# Altium schematic sheet USB_OTG_FS.SchDoc
size A4
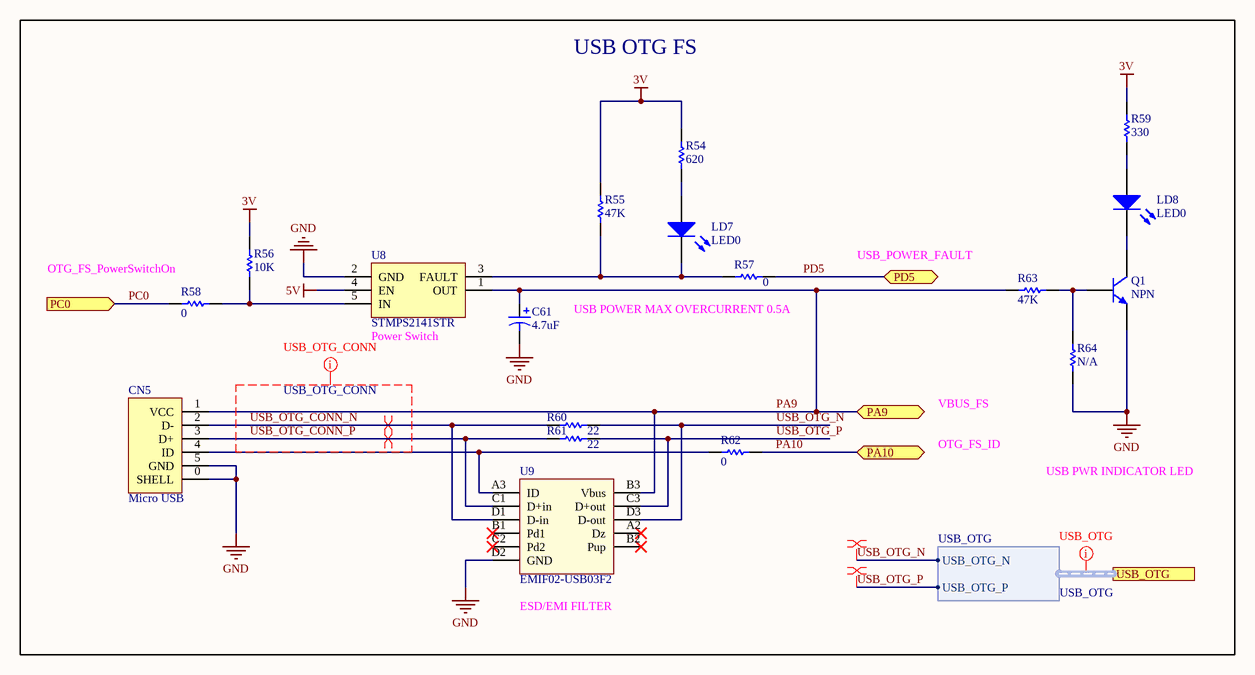
[diagram p0: USB_OTG_FS.SchDoc]

## Parts
C61  value 4.7uF  [TANTALUM CASE A_LEVEL B]  (hidden comment: Cap Pol1)
CN5  Micro USB  [USB MICRO]
LD7  LED0  [LED_0603]
LD8  LED0  [LED_0603]
Q1  NPN  [SOT-23]
R54  value 620  [RESC0402B]  (hidden comment: Res1)
R55  value 47K  [RESC0402B]  (hidden comment: Res1)
R56  value 10K  [RESC0603B]  (hidden comment: Res1)
R57  value 0  [RESC0603B]  (hidden comment: Res1)
R58  value 0  [RESC0603B]  (hidden comment: Res1)
R59  value 330  [RESC0402B]  (hidden comment: Res1)
R60  value 22  [RESC0402B]  (hidden comment: Res1)
R61  value 22  [RESC0402B]  (hidden comment: Res1)
R62  value 0  [RESC0603B]  (hidden comment: Res1)
R63  value 47K  [RESC0402B]  (hidden comment: Res1)
R64  Res1  [RESC0402B]  (value not drawn)
U8  STMPS2141STR  [TSOT-23-5]
U9  EMIF02-USB03F2  [EMIF02-USB03F2]

## Ports
PA9 (bidir), PA10 (bidir), PC0 (in), PD5 (bidir), USB_OTG (harness USB_OTG)

## Harnesses
USB_OTG: USB_OTG_N, USB_OTG_P

## Nets
3V: R54.2 R55.2 R56.2 R59.2
5V: U8.4(EN)
GND: C61.2 CN5.0(SHELL) CN5.5(GND) Q1.3(E) R64.1 U8.2(GND) U9.D2(GND)
PA9: C61.1 CN5.1(VCC) R63.2 U8.1(OUT) U9.B3(Vbus) ; port PA9
PA10: R62.2 ; port PA10
PC0: R58.2 ; port PC0
PD5: R57.2 ; port PD5
USB_OTG_CONN_N: CN5.2(D-) R60.1 U9.D1(D-in)
USB_OTG_CONN_P: CN5.3(D+) R61.1 U9.C1(D+in)
USB_OTG_N: R60.2 U9.D3(D-out) ; port USB_OTG.USB_OTG_N
USB_OTG_P: R61.2 U9.C3(D+out) ; port USB_OTG.USB_OTG_P
NetCN5_4: CN5.4(ID) R62.1 U9.A3(ID)
NetLD7_1: LD7.1(A) R54.1
NetLD7_2: LD7.2(K) R55.1 R57.1 U8.3(FAULT)
NetLD8_1: LD8.1(A) R59.1
NetLD8_2: LD8.2(K) Q1.1(C)
NetQ1_2: Q1.2(B) R63.1 R64.2
NetR56_1: R56.1 R58.1 U8.5(IN)

Not connected (* = marked no-connect by the designer): U9 A2(Dz)* B1(Pd1)* B2(Pup)* C2(Pd2)*

## Layout directives
differential pair: USB_OTG_CONN_N, USB_OTG_CONN_P, USB_OTG_N, USB_OTG_P
net class USB_OTG_CONN: USB_OTG_CONN_N, USB_OTG_CONN_P
net class USB_OTG: (no net found under the mark)

## Notes on the sheet
- USB OTG FS
- (near R58) OTG_FS_PowerSwitchOn
- USB_POWER_FAULT
- (near U8) Power Switch
- (near R57) USB POWER MAX OVERCURRENT 0.5A
- VBUS_FS
- OTG_FS_ID
- USB PWR INDICATOR LED
- (near U9) ESD/EMI FILTER
- Title
- Size:
- Date:
- A4
- Number:
- Time:
- Revision:
- Sheet
- of
- File:

## Library data of the parts
C61 = Cap Pol1_1: Polarized Capacitor (Radial); Published: 8-Jun-2000; LatestRevisionDate: 17-Jul-2002; LatestRevisionNote: Re-released for DXP Platform.; PackageReference: RB7.6-15; Publisher: Altium Limited; PackageDescription: Polarized Capacitor (Radial); 2 Leads
CN5 = USB MICRO
LD7 LD8 = LED0: Typical INFRARED GaAs LED; Published: 8-Jun-2000; LatestRevisionDate: 08-Jul-2005; LatestRevisionNote: Mech Layer 1 removed.; PackageReference: LED-0; Publisher: Altium Limited; PackageDescription: LED; 2 Leads
Q1 = NPN: NPN Bipolar Transistor; Published: 8-Jun-2000; LatestRevisionDate: 17-Jul-2002; LatestRevisionNote: Re-released for DXP Platform.; PackageReference: TO-226-AA; Publisher: Altium Limited; PackageDescription: TO, Flat Index; 3 In-Line, Axial Leads; Body Dia. 4.8mm; Leads 0.55 x 0.51 mm (max); Code_JEDEC: TO-226-AA
R54 = Res1_10: Resistor; Published: 8-Jun-2000; LatestRevisionDate: 17-Jul-2002; LatestRevisionNote: Re-released for DXP Platform.; PackageReference: AXIAL-0.3; Publisher: Altium Limited; PackageDescription: Axial Device, Thru-Hole; 2 Leads; 0.3 in Pin Spacing
R55 R63 = Res1_9: Resistor; Published: 8-Jun-2000; LatestRevisionDate: 17-Jul-2002; LatestRevisionNote: Re-released for DXP Platform.; PackageReference: AXIAL-0.3; Publisher: Altium Limited; PackageDescription: Axial Device, Thru-Hole; 2 Leads; 0.3 in Pin Spacing
R56 = Res1_2: Resistor; Published: 8-Jun-2000; LatestRevisionDate: 17-Jul-2002; LatestRevisionNote: Re-released for DXP Platform.; PackageReference: AXIAL-0.3; Publisher: Altium Limited; PackageDescription: Axial Device, Thru-Hole; 2 Leads; 0.3 in Pin Spacing
R57 R58 R62 = Res1: Resistor; Published: 8-Jun-2000; LatestRevisionDate: 17-Jul-2002; LatestRevisionNote: Re-released for DXP Platform.; PackageReference: AXIAL-0.3; Publisher: Altium Limited; PackageDescription: Axial Device, Thru-Hole; 2 Leads; 0.3 in Pin Spacing
R59 = Res1_12: Resistor; Published: 8-Jun-2000; LatestRevisionDate: 17-Jul-2002; LatestRevisionNote: Re-released for DXP Platform.; PackageReference: AXIAL-0.3; Publisher: Altium Limited; PackageDescription: Axial Device, Thru-Hole; 2 Leads; 0.3 in Pin Spacing
R60 R61 = Res1_11: Resistor; Published: 8-Jun-2000; LatestRevisionDate: 17-Jul-2002; LatestRevisionNote: Re-released for DXP Platform.; PackageReference: AXIAL-0.3; Publisher: Altium Limited; PackageDescription: Axial Device, Thru-Hole; 2 Leads; 0.3 in Pin Spacing
R64 = Res1_13: Resistor; Published: 8-Jun-2000; LatestRevisionDate: 17-Jul-2002; LatestRevisionNote: Re-released for DXP Platform.; PackageReference: AXIAL-0.3; Publisher: Altium Limited; PackageDescription: Axial Device, Thru-Hole; 2 Leads; 0.3 in Pin Spacing; Value: N/A
U8 = STMPS2141STR: Manufacturer: STMicroelectronics; Other Related Documents: STMPS2141 View All Specifications; Switch Type: General Purpose; Number of Outputs: 1; Ratio - Input:Output: 1:1; Output Configuration: High Side; Output Type: N-Channel; Interface: On/Off; Voltage - Load: 2.7 V ~ 5.5 V; Voltage - Supply (Vcc/Vdd): Not Required; Current - Output (Max): 500mA; Rds On (Typ): 90 mOhm; Input Type: Non-Inverting; Fault Protection: Current Limiting (Fixed), Over Temperature, Reverse Current, UVLO; Other Names: 497-6933-2 / STMPS2141STR-ND; Supplier 1: Digikey; Manufacturer Part Number: STMPS2141STR; Stock 1: 9000; Pricing 1: 3000=0.2093, 6000=0.1958, 15000=0.1823, 30000=0.1728 (USD); Standard Package: 3,000; Category: Integrated Circuits (ICs); Family: PMIC - Power Distribution Switches, Load Drivers; Packaging: Tape & Reel (TR); Operating Temperature: -40°C ~ 125°C (TJ); Package / Case: SC-74A, SOT-753; Supplier Device Package: SOT-23-5; Online Catalog: General Purpose; ComponentLink1URL: https://datasheet.ciiva.com/4923/cd00167470-4923447.pdf; ComponentLink1Description: https://datasheet.ciiva.com/4923/cd00167470-4923447.pdf; ComponentLink2URL: https://datasheet.ciiva.com/1962/cd00167470-1962472.pdf; ComponentLink2Description: https://datasheet.ciiva.com/1962/cd00167470-1962472.pdf; ComponentLink3URL: https://datasheet.ciiva.com/1962/cd00167470-1962473.pdf; ComponentLink3Description: https://datasheet.ciiva.com/1962/cd00167470-1962473.pdf; ComponentLink4URL: https://datasheet.ciiva.com/1962/cd00167470-1962474.pdf; ComponentLink4Description: https://datasheet.ciiva.com/1962/cd00167470-1962474.pdf; ComponentLink5URL: https://datasheet.ciiva.com/16491/cd00167470-16491245.pdf; ComponentLink5Description: https://datasheet.ciiva.com/16491/cd00167470-16491245.pdf; ComponentLink6URL: https://datasheet.ciiva.com/15108/getdatasheetpartid-160072-15108990.pdf; ComponentLink6Description: https://datasheet.ciiva.com/15108/getdatasheetpartid-160072-15108990.pdf
U9 = EMIF02-USB03F2: Manufacturer: STMicroelectronics; Other Related Documents: EMIF02-USB03F2 View All Specifications; Number of Channels: 2; Resistance - Channel (Ohms): 33; Values: R = 33 Ohms, C = 20pF; ESD Protection: Yes; Filter Order: 2nd; Online Catalog: IPAD™ Series; Other Names: 497-13521-2 EMIF02USB03F2; Supplier 1: Digikey; Manufacturer Part Number: EMIF02-USB03F2; Stock 1: 5836; Pricing 1: 1=0.68, 10=0.644, 100=0.4574, 500=0.395, 1000=0.3534 (USD); Standard Package: 5,000; Category: Filters; Family: EMI/RFI Filters (LC, RC Networks); Series: EMIF; Packaging: Tape & Reel (TR); Type: Low Pass; Technology: RC (Pi); Center / Cutoff Frequency: -; Attenuation Value: -; Current: -; Applications: USB; Package / Case: 11-WFBGA, FCBGA; Size / Dimension: 0.076" L x 0.057" W (1.94mm x 1.44mm); Height: 0.028" (0.72mm); Operating Temperature: -40°C ~ 85°C; ComponentLink1URL: https://datasheet.ciiva.com/3068/cd00042880-3068450.pdf; ComponentLink1Description: https://datasheet.ciiva.com/3068/cd00042880-3068450.pdf; ComponentLink2URL: https://datasheet.ciiva.com/12394/cd00042880-211729-12394966.pdf; ComponentLink2Description: https://datasheet.ciiva.com/12394/cd00042880-211729-12394966.pdf; ComponentLink3URL: https://datasheet.ciiva.com/16633/cd00042880-16633017.pdf; ComponentLink3Description: https://datasheet.ciiva.com/16633/cd00042880-16633017.pdf